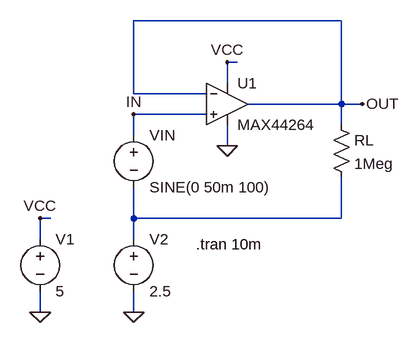
[diagram p0: schematic MAX44264.asc]
MAX44264.asc, the LTspice schematic file:
Version 4
SHEET 1 1720 800
WIRE 624 256 304 256
WIRE 464 320 448 320
WIRE 448 352 448 320
WIRE 304 368 304 256
WIRE 416 368 304 368
WIRE 624 384 624 256
WIRE 624 384 480 384
WIRE 656 384 624 384
WIRE 416 400 304 400
WIRE 624 416 624 384
WIRE 304 432 304 400
WIRE 448 448 448 416
WIRE 176 560 160 560
WIRE 304 560 304 512
WIRE 624 560 624 496
WIRE 624 560 304 560
WIRE 160 592 160 560
WIRE 304 592 304 560
WIRE 160 704 160 672
WIRE 304 704 304 672
FLAG 656 384 OUT
FLAG 160 560 VCC
FLAG 448 320 VCC
FLAG 160 704 0
FLAG 304 400 IN
FLAG 448 448 0
FLAG 304 704 0
SYMBOL voltage 160 576 R0
WINDOW 123 0 0 Left 2
SYMATTR InstName V1
SYMATTR Value 5
SYMBOL res 608 400 R0
SYMATTR InstName RL
SYMATTR Value 1Meg
SYMBOL voltage 304 416 R0
WINDOW 123 0 0 Left 0
WINDOW 39 0 0 Left 0
SYMATTR InstName VIN
SYMATTR Value SINE(0 50m 100)
SYMBOL voltage 304 576 R0
SYMATTR InstName V2
SYMATTR Value 2.5
SYMBOL MAX44264 448 320 R0
SYMATTR InstName U1
TEXT 400 600 Left 2 !.tran 10m

The netlist it stands for:
* MAX44264.asc
V1 VCC 0 5
RL OUT N001 1Meg
VIN IN N001 SINE(0 50m 100)
V2 N001 0 2.5
* U1: MAX44264 (symbol MAX44264 not available, pins judged from their places): In+=IN In-=OUT V+=VCC V-=0 OUT=OUT
.tran 10m
.backanno
.end